# Altium schematic sheet NearField_H_Probe.SchDoc
size A4
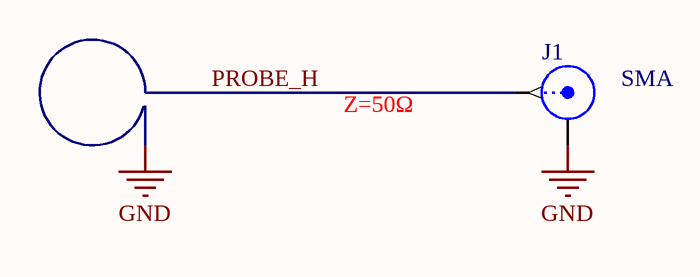
[diagram p0: NearField_H_Probe.SchDoc]

## Parts
J1  SMA  [SMA Edge Launch (Horizontal)]

## Nets
GND: J1.2(Y)
PROBE_H: J1.1(X)

## Notes on the sheet
- Z=50Ω

## Library data of the parts
J1 = SMA: SMA Connector; Supplier 1: Digi-Key; Supplier Part Number 1: A97594-ND